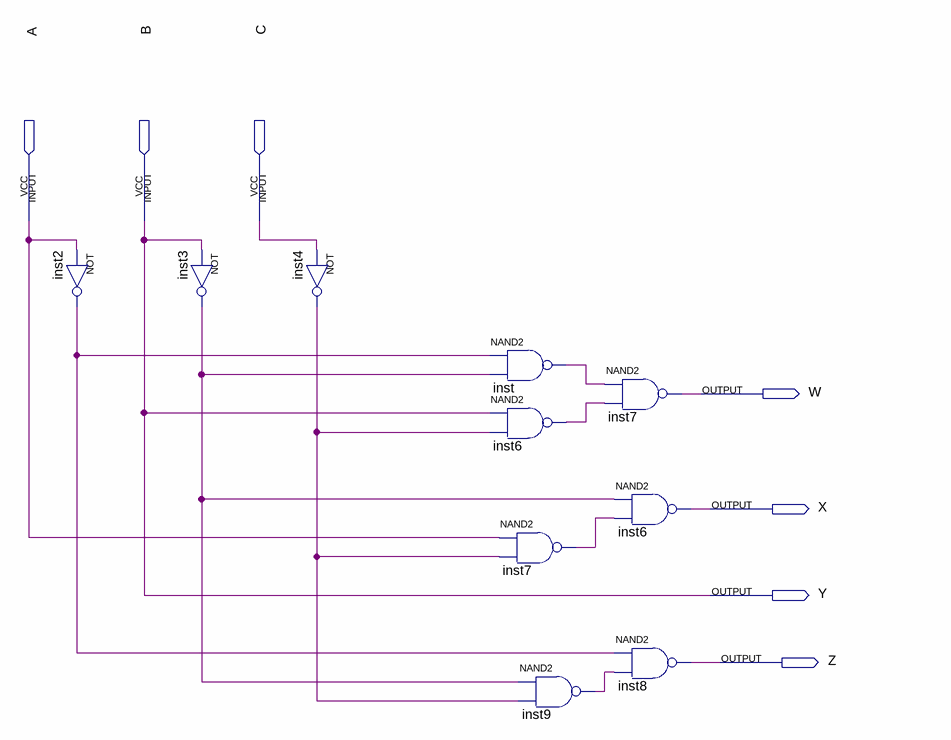
[diagram p0: schematic sheet]
// Quartus schematic Block1.bdf as structural Verilog: 10 symbols, 7 pins
module Block1 (
  input  A,
  input  B,
  input  C,
  output W,
  output X,
  output Y,
  output Z
);

  wire inst2_out, inst3_out, inst4_out, inst6_out, inst7_out, inst9_out, inst_out;

  not inst2 (inst2_out, A);
  not inst3 (inst3_out, B);
  not inst4 (inst4_out, C);
  nand inst (inst_out, inst2_out, inst3_out);
  nand inst6 (inst6_out, B, inst4_out);
  nand inst7 (inst7_out, A, inst4_out);
  nand inst9 (inst9_out, inst3_out, inst4_out);
  nand inst7_dup2 (W, inst_out, inst6_out);
  nand inst6_dup2 (X, inst3_out, inst7_out);
  nand inst8 (Z, inst2_out, inst9_out);

  assign Y = B;
endmodule
